# EAGLE design SHT31_Minimount (EAGLE 7.3.0)
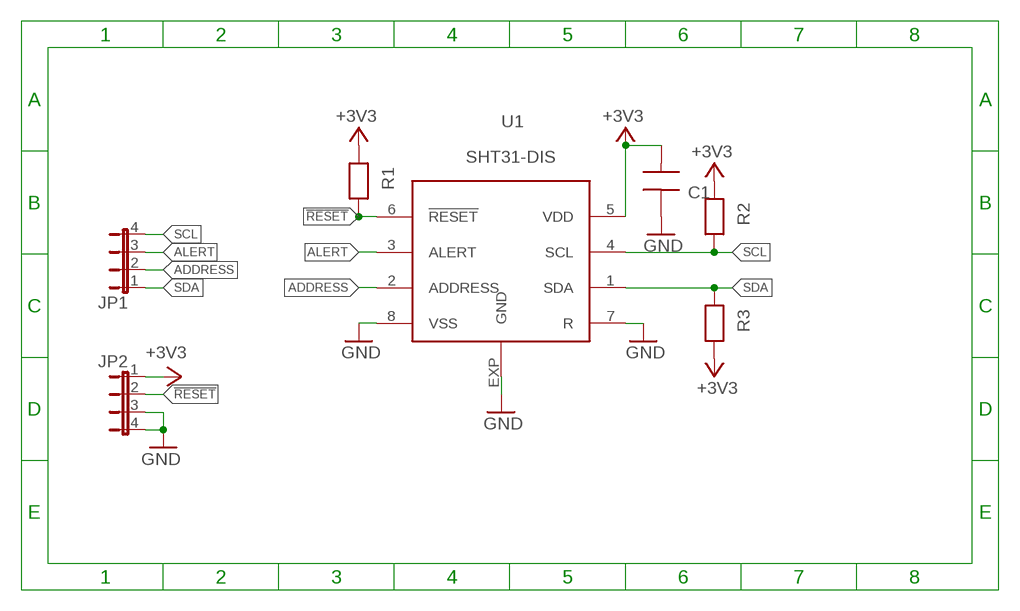
[diagram p0: schematic, sheet 1]

## Parts
C1  C0603  [0603]
JP1  JP4E  [JP4]
JP2  JP4E  [JP4]
R1  R0603  [0603]
R2  R0603  [0603]
R3  R0603  [0603]
U1  SHT31-DIS  [DFN8-3X3]

## Nets
!RESET!: JP2.2 R1.1 U1.6(!RESET!)
+3V3: C1.1 JP2.1 R1.2 R2.2 R3.1 U1.5(VDD)
ADDRESS: JP1.2 U1.2(ADDRESS)
ALERT: JP1.3 U1.3(ALERT)
GND: C1.2 JP2.3 JP2.4 U1.7(R) U1.8(VSS) U1.EXP(GND)
SCL: JP1.4 R2.1 U1.4(SCL)
SDA: JP1.1 R3.2 U1.1(SDA)

## Library data of the parts
C1 = Messstation:C0603: Capacitor 0603
JP1 JP2 = jumper:JP4E: JUMPER
R1-R3 = Messstation:R0603: Resistor 0603
U1 = Messstation:SHT31-DIS

## Board
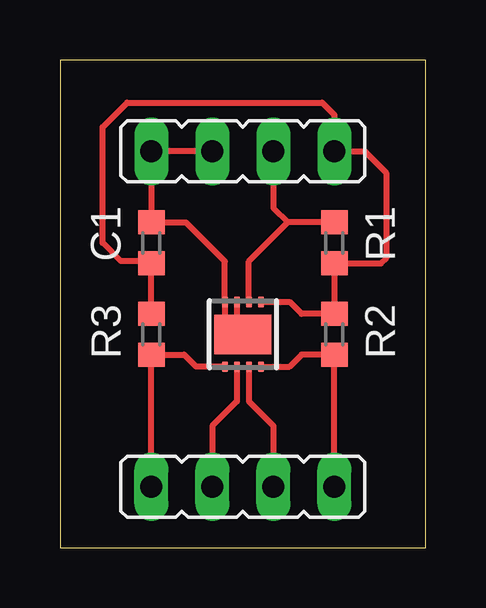
[diagram p1: board, top side]

Size 15.24 x 20.32 mm. Coordinates in mm from the lower left corner, seen from the top.
Outline: 0,0 15.24,0 15.24,20.32 0,20.32 0,0
Copper layers (1*16): Top 0.035mm / dielectric 1.5mm / Bottom 0.035mm
Design rules "default *": minimum track width 10mil, minimum drill 24mil, track to track 8mil, track to pad 8mil, pad to pad 8mil, via to via 8mil, smd to smd 8mil, copper to edge 40mil, drill to drill 8mil, minimum pad ring 10mil, minimum via ring 8mil, stop-mask expansion 4mil, vias tented up to drill 0mil, thermal gap 10mil

### Footprints (pad centres in the part's own frame; a part is rotated, then mirrored left to right if it is on the bottom)
0603 = smd 1 x 1.1: 1 -0.85,0; 2 0.85,0
JP4 = drill 0.914 long: 1 -3.81,0; 2 -1.27,0; 3 1.27,0; 4 3.81,0
DFN8-3X3 = smd 0.25 x 0.45: 1 -0.75,-1.35; 2 -0.25,-1.35; 3 0.25,-1.35; 4 0.75,-1.35; 5 0.75,1.35; 6 0.25,1.35; 7 -0.25,1.35; 8 -0.75,1.35 | smd 2.38 x 1.65: EXP 0,0

### Placement (x,y rotation side)
C1  3.81,12.7 90 top
JP1  7.62,2.54 0 top
JP2  7.62,16.51 180 top
R1  11.43,12.7 270 top
R2  11.43,8.89 90 top
R3  3.81,8.89 270 top
U1  7.62,8.89 0 top

### Tracks (layer width: path | path; a pad name or v marks a point on that pad's centre or on a via)
!RESET!
  Top 0.254: U1.6 7.87,11.93 9.49,13.55 | R1.1 9.49,13.55 | JP2.2 8.89,14.15 9.49,13.55
+3V3
  Top 0.254: U1.5 9.57,10.24 10.07,9.74 R2.2 R1.2 13.37,11.85 13.59,12.06 13.59,15.62 12.7,16.51 JP2.1 11.43,18.03 10.92,18.54 2.79,18.54 1.78,17.53 1.78,12.7 2.54,11.94 3.81,11.94 C1.1 R3.1
ADDRESS
  Top 0.254: U1.2 7.37,6.1 6.35,5.08 JP1.2
ALERT
  Top 0.254: U1.3 7.87,6.1 8.89,5.08 JP1.3
GND
  Top 0.254: U1.7 7.37,9.14 U1.EXP 6.87,9.64 U1.8 6.87,11.93 5.25,13.55 C1.2 JP2.4 JP2.3
SCL
  Top 0.254: JP1.4 R2.1 10.07,8.04 9.57,7.54 U1.4
SDA
  Top 0.254: JP1.1 R3.2 5.17,8.04 5.67,7.54 U1.1